# EasyEDA Pro project ProPrj_智能警报器（终版）_2025-03-04_22-10-02_2025-04-22.epro, board 警报发送装置PCB
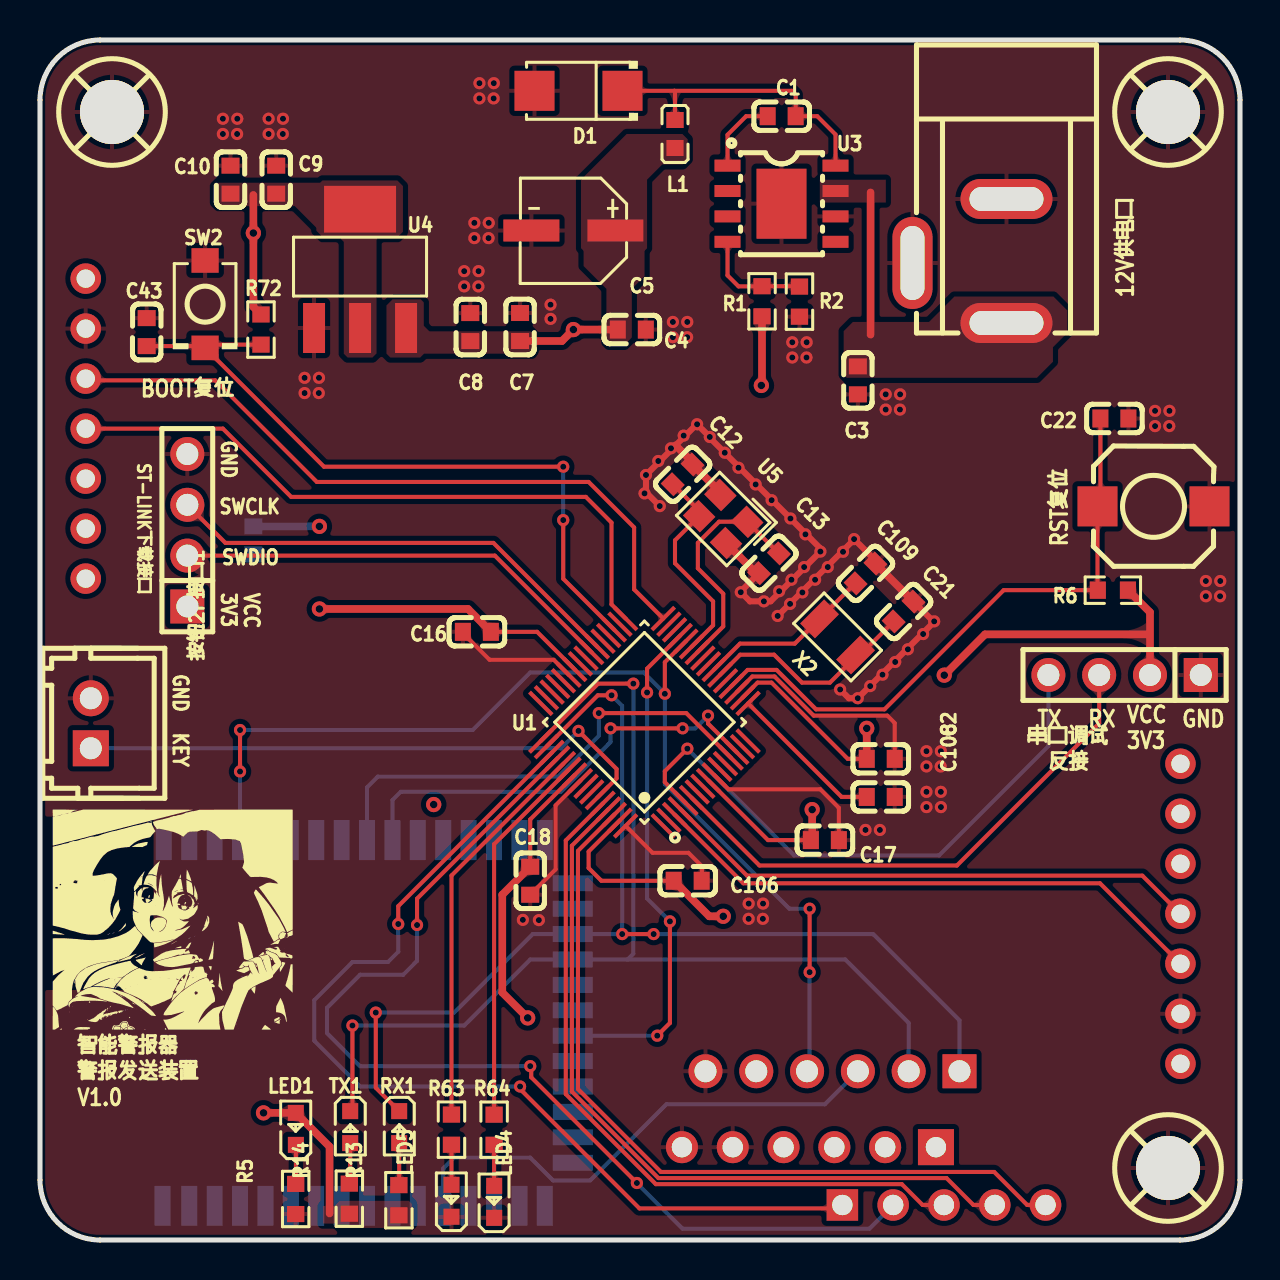
[diagram p18: board, top side]
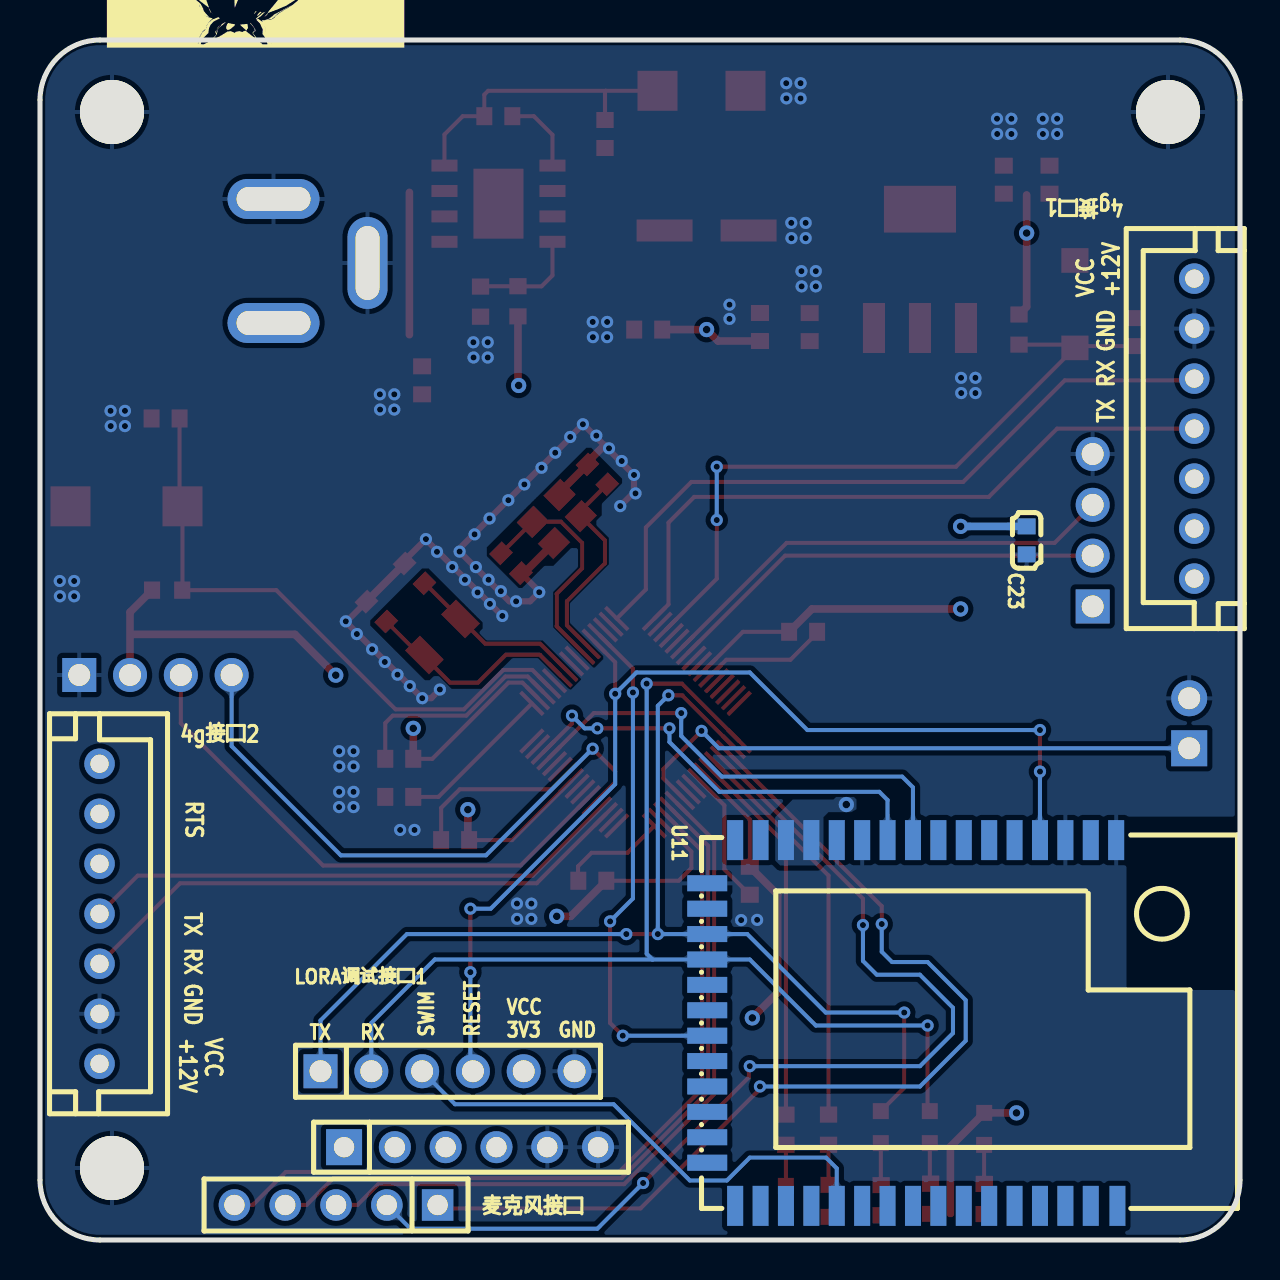
[diagram p19: board, bottom side, seen from below]

Outline 60 x 60 mm; copper layers: Top Layer, 电源层, 接地层, Bottom Layer. Coordinates in mm from the lower left corner of the outline.
Outline path: 0,57 0,3 arc(0.88,0.88) 3,0 57,0 arc(59.12,0.88) 60,3 60,57 arc(59.12,59.12) 57,60 3,60 arc(0.88,59.12) 0,57
Stack: Top Layer 0.035mm 外层铜厚1oz / Dielectric1 0.2104mm 7628 RC49% 8.6mil / 电源层 0.0152mm 内层铜厚 / Dielectric2 1.065mm 1.1mm H/HOZ Copper / 接地层 0.0152mm 内层铜厚 / Dielectric3 0.2104mm 7628 RC49% 8.6mil / Bottom Layer 0.035mm 外层铜厚1oz

## Design rules (mm)
template: 自定义配置
spacing copperThickness1oz (default): track to track 0.102, other pairs 0.152 to 0.3
spacing copperThickness2oz: track to track 0.203, other pairs 0.152 to 0.3
track width copperThickness1oz (default): min 0.203, default 0.203, max 2.54
track width copperThickness2oz: min 0.203, default 0.254, max 2.54
track width GND: min 0.203, default 0.305, max 2.54
track width VCC: min 0.203, default 0.381, max 2.54
differential pair differentialPair (default): width min 0.127, default 0.254, max 2.54; gap min 0.152, default 0.152
via viaSize (default): diameter min 0.5, default 0.61, max 10; hole min 0.3, default 0.305, max 6.299
via VCC: diameter min 0.61, default 0.762, max 10; hole min 0.305, default 0.381, max 6.299
net VCC+3.3V uses VCC
net GND uses GND
net VCC_IN uses VCC
net VCC+5V uses VCC

## Placement (name value [footprint] x y rotation side)
C1  10NF  [C0603]  37.08 56.19 0 top
C2  100nF  [C0603]  42.04 24.06 180 top
C3  10uF  [C0603]  40.89 42.98 90 top
C4  10nF  [C0603]  29.59 45.52 180 top
C5  330uF  [CAP-SMD_BD5.0-L5.3-W5.3-FD]  26.67 50.47 180 top
C7  10uF  [C0603]  24 45.65 270 top
C8  100nF  [C0603]  21.51 45.65 270 top
C9  10uF  [C0603]  11.81 53.02 90 top
C10  100nF  [C0603]  9.53 53.02 90 top
C12  12pF  [C0603]  32.13 38.28 45 top
C13  12pF  [C0603]  36.45 33.84 225 top
C16  100nF  [C0603]  21.84 30.41 0 top
C17  100nF  [C0603]  39.24 20 180 top
C18  100nF  [C0603]  24.51 17.96 90 top
C21  10pF  [C0603]  43.18 31.42 225 top
C22  10nF  [C0603]  53.72 41.08 180 top
C23  100nF  [C0603]  10.67 34.98 90 bottom
C43  100nF  [C0603]  5.33 45.39 270 top
C106  100nF  [C0603]  32.38 17.96 180 top
C108  2.2uF  [C0603]  42.04 22.15 180 top
C109  10pF  [C0603]  41.28 33.33 225 top
D1  B340A  [SMA_L4.3-W2.6-LS5.1-RD]  26.92 57.46 180 top
DC2  -  [DC-005_2.5]  48.01 49.08 90 top
H6  -  [HDR-TH_4P-P2.54-V-M]  7.37 35.49 90 top
H7  -  [HDR-TH_4P-P2.54-V-M]  54.23 28.25 180 top
L1  15uH  [L0603]  31.75 55.3 90 top
LED1  -  [LED_0603]  12.78 5.61 90 top
LED4  KT-0603R  [LED0603-RD]  22.71 1.91 90 top
LED5  KT-0603R  [LED0603-RD]  20.57 1.96 90 top
LORA调试接口1  PZ254-1-06-Z-2.5-G1  [HDR-TH_6P-P2.54-V-M]  39.62 8.44 180 bottom
R1  10KΩ  [R0603]  36.1 46.94 90 top
R2  3.24KΩ  [R0603]  37.97 46.92 270 top
R5  2kΩ  [R0603]  12.78 2.05 270 top
R6  1KΩ  [R0603]  53.64 32.49 0 top
R13  1kΩ  [R0603]  17.94 1.99 270 top
R14  1kΩ  [R0603]  15.47 2.07 270 top
R63  1kΩ  [R0603]  20.57 5.52 90 top
R64  1kΩ  [R0603]  22.7 5.51 90 top
R72  4.7kΩ  [R0603]  11.05 45.52 270 top
RX1  KT-0603R  [LED0603-RD]  17.96 5.64 270 top
SCREW1  -  [M3螺丝]  56.4 56.4 0 top
SCREW2  -  [M3螺丝]  3.6 56.4 0 top
SCREW3  -  [M3螺丝]  56.4 3.6 0 top
SW2  TS-1088-AR02016  [SW-SMD_L3.9-W3.0-P4.45]  8.25 46.79 270 top
TX1  KT-0603R  [LED0603-RD]  15.51 5.64 270 top
U1  HT32F52352  [LQFP-64_L7.0-W7.0-P0.40-LS9.2-BL]  30.22 25.89 45 top
U3  TPS5430DDAR  [ESOP-8_L4.9-W3.9-P1.27-LS6.0-TL-EP]  37.08 51.81 0 top
U4  AMS1117-3.3  [SOT-223-3_L6.5-W3.4-P2.30-LS7.0-BR]  16 48.57 270 top
U5  8MHz  [CRYSTAL-SMD_4P-L2.5-W2.0-BL]  34.16 36.05 135 top
U9  轻触开关/软触开关(无声)/贴片6*6*5  [SW-SMD_L6.0-W5.9-LS6.6]  55.68 36.68 180 top
U11  WH-L101-L-C  [COMM-SMD_WH-L101-L-C]  16.38 10.85 270 bottom
U63  ZX-PM2.54-1-6PY  [HDR-TH_6P-P2.54-V-F]  38.45 4.64 180 bottom
U65  ZX-PM2.54-1-5PY  [HDR-TH_5P-P2.54-V-F-B]  45.2 1.75 0 bottom
U66  ZX-XH2.54-7PZZ  [CONN-TH_7P-P2.50_XH2.54MM-7P]  2.29 40.57 270 bottom
U67  ZX-XH2.54-7PZZ  [CONN-TH_7P-P2.50_XH2.54MM-7P]  57.02 16.31 90 bottom
X2  32.768kHz  [OSC-SMD_L3.2-W1.5]  39.88 30.16 135 top
按钮2P接口1  ZX-XH2.54-2PZZ  [CONN-TH_2P-P2.50_HX25003-2A]  2.54 25.84 90 top

## Footprints (pads in the part's own frame, mm; a bottom-side part is the same pattern mirrored in y, then rotated)
C0603
  rect 0.8x0.9 smd: 1(-0.7,0) 2(0.7,0)
CAP-SMD_BD5.0-L5.3-W5.3-FD
  rect 2.8x1.1 smd: 1(-2.1,0) 2(2.1,0)
COMM-SMD_WH-L101-L-C
  rect 2x0.8 smd: 1(-9.144,10.192) 2(-9.144,8.922) 3(-9.144,7.652) 4(-9.144,6.382) 5(-9.144,5.112) 6(-9.144,3.842) 7(-9.144,2.572) 8(-9.144,1.302) 9(-9.144,0.032) 10(-9.144,-1.238) 11(-9.144,-2.509) 12(-9.144,-3.779) 13(-9.144,-5.048) 14(-9.144,-6.319) 15(-9.144,-7.588) 16(-9.144,-8.858) 29(9.144,-8.858) 30(9.144,-7.588) 31(9.144,-6.319) 32(9.144,-5.048) 33(9.144,-3.779) 34(9.144,-2.509) 35(9.144,-1.238) 36(9.144,0.032) 37(9.144,1.302) 38(9.144,2.572) 39(9.144,3.842) 40(9.144,5.112) 41(9.144,6.382) 42(9.144,7.652) 43(9.144,8.922) 44(9.144,10.255)
  rect 0.8x2 smd: 17(-6.985,-10.255) 18(-5.715,-10.255) 19(-4.445,-10.255) 20(-3.175,-10.255) 21(-1.905,-10.255) 22(-0.635,-10.255) 23(0.635,-10.255) 24(1.905,-10.255) 25(3.175,-10.255) 26(4.445,-10.255) 27(5.715,-10.255) 28(6.985,-10.255)
CONN-TH_2P-P2.50_HX25003-2A
  rect 1.8x1.8 hole 1.1: 1(-1.25,0)
  round 1.8 hole 1.1: 2(1.25,0)
CONN-TH_7P-P2.50_XH2.54MM-7P
  round 1.524 hole 0.914: 1(-7.5,0) 2(-5,0) 3(-2.5,0) 4(0,0) 5(2.5,0) 6(5,0) 7(7.5,0)
CRYSTAL-SMD_4P-L2.5-W2.0-BL
  rect 1.2x1.1 smd: 1(-0.95,-0.75) 2(0.95,-0.75) 3(0.95,0.75) 4(-0.95,0.75)
DC-005_2.5
  oval 2x4.6 hole 1.2x3.7: 1(-3.227,-0.318) 2(2.973,-0.318)
  oval 4.6x2 hole 3.7x1.2: 3(-0.227,4.382)
ESOP-8_L4.9-W3.9-P1.27-LS6.0-TL-EP
  rect 1.3x0.6 smd: 1(-2.7,1.905) 2(-2.7,0.635) 3(-2.7,-0.635) 4(-2.7,-1.905) 5(2.7,-1.905) 6(2.7,-0.635) 7(2.7,0.635) 8(2.7,1.905)
  rect 2.5x3.5 smd: 9(0,0)
HDR-TH_4P-P2.54-V-M
  rect 1.7x1.7 hole 1.1: 1(-3.81,0)
  round 1.7 hole 1.1: 2(-1.27,0) 3(1.27,0) 4(3.81,0)
HDR-TH_5P-P2.54-V-F-B
  rect 1.575x1.575 hole 1.02: 1(-5.08,0)
  round 1.575 hole 1.02: 2(-2.54,0) 3(0,0) 4(2.54,0) 5(5.08,0)
HDR-TH_6P-P2.54-V-F
  rect 1.8x1.8 hole 1.02: 1(-6.35,0)
  round 1.6 hole 1.02: 2(-3.81,0) 3(-1.27,0) 4(1.27,0) 5(3.81,0) 6(6.35,0)
HDR-TH_6P-P2.54-V-M
  rect 1.7x1.7 hole 1.1: 1(-6.35,0)
  round 1.7 hole 1.1: 2(-3.81,0) 3(-1.27,0) 4(1.27,0) 5(3.81,0) 6(6.35,0)
L0603
  rect 0.8x0.864 smd: 1(-0.7,0) 2(0.7,0)
LED0603-RD
  rect 0.8x0.8 smd: 1(-0.799,0) 2(0.799,0)
LED_0603
  rect 0.8x0.8 smd: 1(-0.851,-0.01) 2(0.75,-0.005)
LQFP-64_L7.0-W7.0-P0.40-LS9.2-BL
  rect 0.2x1.6 smd: 1(-3,-4.33) 2(-2.6,-4.33) 3(-2.2,-4.33) 4(-1.8,-4.33) 5(-1.4,-4.33) 6(-1,-4.33) 7(-0.6,-4.33) 8(-0.2,-4.33) 9(0.2,-4.33) 10(0.6,-4.33) 11(1,-4.33) 12(1.4,-4.33) 13(1.8,-4.33) 14(2.2,-4.33) 15(2.6,-4.33) 16(3,-4.33) 33(3,4.33) 34(2.6,4.33) 35(2.2,4.33) 36(1.8,4.33) 37(1.4,4.33) 38(1,4.33) 39(0.6,4.33) 40(0.2,4.33) 41(-0.2,4.33) 42(-0.6,4.33) 43(-1,4.33) 44(-1.4,4.33) 45(-1.8,4.33) 46(-2.2,4.33) 47(-2.6,4.33) 48(-3,4.33)
  rect 1.6x0.2 smd: 17(4.33,-3) 18(4.33,-2.6) 19(4.33,-2.2) 20(4.33,-1.8) 21(4.33,-1.4) 22(4.33,-1) 23(4.33,-0.6) 24(4.33,-0.2) 25(4.33,0.2) 26(4.33,0.6) 27(4.33,1) 28(4.33,1.4) 29(4.33,1.8) 30(4.33,2.2) 31(4.33,2.6) 32(4.33,3) 49(-4.33,3) 50(-4.33,2.6) 51(-4.33,2.2) 52(-4.33,1.8) 53(-4.33,1.4) 54(-4.33,1) 55(-4.33,0.6) 56(-4.33,0.2) 57(-4.33,-0.2) 58(-4.33,-0.6) 59(-4.33,-1) 60(-4.33,-1.4) 61(-4.33,-1.8) 62(-4.33,-2.2) 63(-4.33,-2.6) 64(-4.33,-3)
M3螺丝
  round 3.2 hole 3.2: 1(0,0)
OSC-SMD_L3.2-W1.5
  rect 1.05x1.7 smd: 1(-1.275,0) 2(1.275,0)
R0603
  rect 0.806x0.864 smd: 1(-0.753,0) 2(0.753,0)
SMA_L4.3-W2.6-LS5.1-RD
  rect 2x2 smd: 1(-2.2,0) 2(2.2,0)
SOT-223-3_L6.5-W3.4-P2.30-LS7.0-BR
  rect 2.5x1.1 smd: 1(2.97,-2.3) 2(2.97,0) 3(2.97,2.3)
  rect 2.34x3.6 smd: 4(-2.97,0)
SW-SMD_L3.9-W3.0-P4.45
  rect 1.23x1.36 smd: 1(-2.185,0) 2(2.185,0)
SW-SMD_L6.0-W5.9-LS6.6
  rect 2x2 smd: 1(-2.8,0) 2(2.8,0)

## Nets
As in the schematic.

Pads without a net: U1 1 2 7 8 11 12 15 16 21 24 25 30 31 36 40 41 44 45 46 47 48 57 58; U3 2 3 5; U11 2 5 6 7 8 15 16 18 21 22 24 25 26 27 28 29 30 31 32 34 35 36 37 38 39 40 41 42 43 44; U63 1 3 4; U66 5 7; U67 5 7

## Via types
v1: diameter 0.762, hole 0.381, Top Layer to Bottom Layer, 12 vias
v2: diameter 0.61, hole 0.305, Top Layer to Bottom Layer, 124 vias

## Routing (per net, layer and track width the routed paths; a pad name or vN(x,y) marks a point on that pad's centre or on a via; arc(x,y) is an arc through that point)
GND: length 82.3
  Top Layer w0.203: U1.10 34.43,22.53 39.01,22.53 39.94,21.61 C17.1 ; 26.45,28.24 25.69,29.01 22.48,29.01 21.14,30.35 C16.1 ; C2.1 42.74,25.85 42.37,26.22 38.69,26.22 36.73,28.17 35.62,28.17 U1.19 ; 27.02,22.97 25.78,21.73 25.78,18.53 24.51,17.26 ; 29.28,20.71 30.63,19.36 32.42,19.36 33.1,18.69 33.1,17.97 C106.1
  Top Layer w0.305: 43.68,31.92 44.66,30.93 v2(44.71,30.93) 44.71,30.91 v2(40.89,27.09) 40.44,27.09 v2(40.01,27.52) ; C109.1 41.77,33.98 v2(40.7,35.04) 40.7,35.02 v2(36.88,31.2) ; v2(30.99,36.7) 30.35,37.33 v2(30.23,37.33) 30.3,37.4 v2(30.3,38.25) 31.78,39.73 32.83,40.79 v2(32.85,40.79) v2(33.49,40.15) 33.49,40.11 v2(34.24,39.36) 34.24,39.36 v2(37.52,36.08) 39.02,34.58 v2(39.02,34.42) 36.53,31.93 v2(36.19,31.93) 35.5,31.93 v2(35.04,32.39) 35.04,32.43 C13.2
  Top Layer w0.381: C109.1 43.68,31.92 ; 31.78,39.73 32.63,38.89 C12.2 34.02,37.39 U5.2 ; C13.2 35.81,33.34 U5.4
  vias: v2(9.14,56.06) v2(9.14,55.3) v2(9.86,56.06) v2(9.85,55.3) v2(11.43,56.06) v2(11.43,55.3) v2(12.15,56.06) v2(12.14,55.3) v2(13.23,43.11) v2(13.23,42.35) v2(13.95,43.11) v2(13.94,42.35) v2(21.21,48.44) v2(21.21,47.68) v2(21.72,50.86) v2(21.72,50.09) v2(21.93,48.44) v2(21.92,47.68) v2(21.97,57.84) v2(21.97,57.08) v2(22.44,50.86) v2(22.43,50.09) v2(22.69,57.84) v2(22.68,57.08) v2(24.14,16.01) v2(24.94,15.99) v2(25.53,46.77) v2(25.53,46.06) v2(30.91,38.95) v2(31.55,39.58) v2(31.64,45.9) v2(31.64,45.14) v2(32.18,40.22) v2(32.36,45.9) v2(32.36,45.14) v2(34.93,38.61) v2(35.43,16.82) v2(35.43,16.06) v2(35.78,37.78) v2(36.14,16.06) v2(36.15,16.82) v2(36.58,36.99) v2(36.96,32.44) v2(37.5,31.81) v2(37.61,44.89) v2(37.61,44.12) v2(37.57,33.01) v2(38.12,32.38) v2(38.21,33.65) v2(38.33,44.89) v2(38.32,44.12) v2(38.27,35.28) v2(38.75,33.01) v2(39.39,33.65) v2(40.15,34.41) v2(41.28,20.5) v2(41.51,27.69) v2(41.99,20.5) v2(42.12,28.27) v2(42.29,42.28) v2(42.29,41.52) v2(42.76,28.9) v2(43.01,42.28) v2(43,41.52) v2(43.4,29.54) v2(44.16,30.3) v2(44.32,24.44) v2(44.32,23.68) v2(44.32,22.41) v2(44.32,21.65) v2(45.04,24.44) v2(45.03,23.68) v2(45.04,22.41) v2(45.05,21.65) v2(55.75,41.46) v2(55.75,40.7) v2(56.47,41.46) v2(56.46,40.7) v2(58.29,32.95) v2(58.29,32.19) v2(59.01,32.95) v2(59,32.19)
VCC+3.3V: length 202.6
  Top Layer w0.203: C106.2 28.07,17.96 27.43,18.6 27.43,19.42 U1.63 ; C17.2 36.4,20 33.43,22.97 ; C16.2 24.85,30.41 U1.42 ; 41.34,24.06 40.39,24.06 36.58,27.87 35.88,27.87 U1.18 ; U1.55 24.51,21.03 C18.2
  Top Layer w0.381: C18.2 23.11,17.27 23.11,12.38 v1(24.38,11.1) ; v1(45.21,28.24) 47.25,30.28 55.37,30.28 ; C16.2 21.4,31.55 v1(13.97,31.55) ; R72.1 10.67,46.66 v1(10.67,50.35) 10.67,52.25 ; v1(11.18,6.36) LED1.2 14.48,4.67 14.48,1.33 ; v1(34.16,16.19) 33.46,16.19 C106.2 ; v1(38.61,21.52) 38.61,20.06 C17.2 ; R6.2 55.5,31.39 H7.2 ; 41.34,24.06 v1(41.34,25.58)
  电源层 w0.381: v1(34.16,16.19) 34.16,21.48 ; v1(34.16,16.19) 32,18.34 23.11,18.34 v1(19.69,21.77) 13.97,27.49 v1(13.97,31.55) ; v1(34.16,16.19) 34.16,11.07 ; 34.16,21.48 34.16,22.92 36.83,25.58 v1(41.34,25.58) 42.55,25.58 v1(45.21,28.24) ; 34.16,21.48 34.2,21.52 v1(38.61,21.52) ; H6.1 7.49,31.55 v1(13.97,31.55) ; 34.16,11.07 34.16,10.09 LORA调试接口1.5 ; 34.16,11.07 34.13,11.1 v1(24.38,11.1) 19.63,6.36 v1(11.18,6.36) ; v1(13.97,31.55) v1(13.97,35.68) 13.97,39.3 10.67,42.6 v1(10.67,50.35)
  Bottom Layer w0.381: C23.2 v1(13.97,35.68)
VCC+5V: length 69.5
  Top Layer w0.381: v1(36.07,42.73) 36.1,42.76 36.1,46.18 ; C7.2 26.1,44.95 v1(26.67,45.52) C4.2
  电源层 w0.381: U63.2 42.26,6.25 42.54,6.53 47.62,6.53 49.15,8.06 49.15,15.17 46.1,18.22 46.1,32.69 v1(36.07,42.73) 27.81,42.73 26.67,43.87 v1(26.67,45.52)
VCC_IN: length 105.8
  Top Layer w0.381: 41.53,52.38 41.53,45.27
  电源层 w0.762: U66.1 7.11,52.89 7.11,55.94 9.14,57.97 18.29,57.97 24,52.25 28.45,52.25 34.85,45.85 DC2.1 48.32,23.36 51.94,19.74 51.94,11.99 55.12,8.81 U67.1
4G_RX1: length 35.7
  Top Layer w0.203: 31.16,31.07 29.71,32.53 29.71,35.63 27.43,37.9 13.84,37.9 8.76,42.98 2.37,42.98 U66.3
4G_RX2: length 28.4
  Top Layer w0.203: U67.3 53,17.84 35.16,17.84 U1.3
4G_TX1: length 33.3
  Top Layer w0.203: 29.28,31.07 28.57,31.78 28.57,35.87 27.29,37.16 12.56,37.16 9.14,40.57 U66.4
4G_TX2: length 27.2
  Top Layer w0.203: 32.01,21.56 35.35,18.22 55.12,18.22 U67.4
BEEP_PA25: length 50.4
  Top Layer w0.203: U65.1 39.95,1.58 29.97,1.58 24,7.55 v2(24,7.68) ; v2(17.91,15.8) 17.91,16.69 U1.51
  Bottom Layer w0.203: v2(24,7.68) 16,7.68 13.72,9.96 13.72,11.99 15.62,13.9 17.4,13.9 17.91,14.41 v2(17.91,15.8)
BEEP_PA26: length 53.2
  Top Layer w0.203: v2(18.85,15.75) 18.85,17.07 25.89,24.1 ; v2(24.51,8.69) 24.51,8.75 24.56,8.8 24.56,8.13 v2(29.84,2.85)
  Bottom Layer w0.203: U65.2 41.47,0.56 32.13,0.56 v2(29.84,2.85) ; v2(24.51,8.69) 16,8.69 14.35,10.34 14.35,11.61 16,13.26 18.16,13.26 18.85,13.95 v2(18.85,15.75)
BEEP_PA27: length 36.5
  Top Layer w0.203: U65.3 44.13,1.75 43.09,2.79 30.79,2.79 26.29,7.29 26.29,19.98 U1.60
BEEP_PB2: length 38.4
  Top Layer w0.203: U65.4 46.67,1.75 45.32,3.1 30.92,3.1 26.59,7.42 26.59,19.72 28.43,21.56
BEEP_PB3: length 40.3
  Top Layer w0.203: U65.5 49.36,1.75 47.71,3.4 31.04,3.4 26.9,7.55 26.9,19.46 U1.62
BOOT: length 35.4
  Top Layer w0.203: SW2.2 8.17,44.69 C43.2 ; SW2.2 8.42,44.77 R72.2 ; SW2.2 14.2,38.66 v2(26.16,38.66) ; v2(26.16,36) 26.16,33.06 U1.35
  Bottom Layer w0.203: v2(26.16,36) v2(26.16,38.66)
LORA_IO1: length 24
  Top Layer w0.203: v2(27.94,26.34) 32.31,26.34 34.56,24.1
  Bottom Layer w0.203: U11.9 16.35,22.63 16.89,23.17 25.91,23.17 27.94,25.2 v2(27.94,26.34)
LORA_IO2: length 22.4
  Top Layer w0.203: U1.14 33.4,25.82 v2(33.4,26.22) ; v2(28.53,25.58) v2(32.13,25.58)
  Bottom Layer w0.203: v2(28.53,25.58) 28.53,24.9 26.03,22.41 18.03,22.41 17.62,22 U11.10 ; v2(32.13,25.58) 32.77,25.58 v2(33.4,26.22)
LORA_RESET: length 54
  Top Layer w0.203: U1.28 31.24,28.89 v2(31.24,27.31) ; v2(10,23.42) v2(10,25.5) ; v2(38.48,16.57) v2(38.48,13.39)
  Bottom Layer w0.203: LORA调试接口1.4 38.48,8.56 v2(38.48,13.39) ; v2(38.48,16.57) 37.47,16.57 31.24,22.79 v2(31.24,27.31) 30.18,28.38 24.51,28.38 21.63,25.5 v2(10,25.5) ; 10,20 v2(10,23.42)
LORA_RX: length 57
  Top Layer w0.203: 25.04,24.95 27.91,27.82 v2(29.67,27.82) ; v2(15.62,10.72) 15.62,6.55 15.51,6.44
  Bottom Layer w0.203: 29.38,14.03 U11.20 24.51,14.03 21.21,10.72 v2(15.62,10.72) ; 29.38,14.03 29.67,14.31 v2(29.67,27.82) ; 29.38,14.03 40.26,14.03 43.43,10.85 LORA调试接口1.2
LORA_SWIM: length 25.6
  Bottom Layer w0.203: U11.33 20.16,3.58 20.7,4.12 24.51,4.12 25.65,2.98 27.51,2.98 31.32,6.79 39.24,6.79 LORA调试接口1.3
LORA_TX: length 57
  Top Layer w0.203: U1.50 27.89,27.24 v2(28.58,27.24) ; v2(16.79,11.37) 16.79,7.61 17.96,6.44 ; v2(29.11,15.3) v2(30.68,15.3)
  Bottom Layer w0.203: v2(28.58,27.24) 29.11,26.71 v2(29.11,15.3) U11.19 24.64,15.3 20.71,11.37 v2(16.79,11.37) ; v2(30.68,15.3) 41.66,15.3 45.97,10.98 LORA调试接口1.1
LORA_WAKE: length 25.7
  Top Layer w0.203: v2(31.5,15.93) 31.5,10.85 v2(30.86,10.22) ; v2(30.35,27.38) 30.35,28.57 32.01,30.22
  Bottom Layer w0.203: v2(31.5,15.93) 30.35,17.07 v2(30.35,27.38) ; U11.23 v2(30.86,10.22)
NRST: length 30.6
  Top Layer w0.203: 34.56,27.68 35.38,28.5 36.83,28.5 38.8,26.53 42.22,26.53 48.18,32.49 52.89,32.49 52.88,32.51 U9.2 53.02,36.83 53.02,41.08
PA4: length 29.7
  Top Layer w0.203: v2(32.37,24.57) 31.24,23.44 31.24,22.89 U1.5
  Bottom Layer w0.203: v2(32.37,24.57) 37.7,19.23 44.96,19.23 50.42,24.69 H7.4
PA5: length 27.1
  Top Layer w0.203: 32.58,22.12 35.97,18.72 45.85,18.72 52.96,25.84 H7.3
PA12: length 23.4
  Top Layer w0.203: 27.87,29.66 22.67,34.85 9.27,34.85 H6.3
PA13: length 22.2
  Top Layer w0.203: H6.2 22.74,34.22 U1.39
PC3: length 29.3
  Top Layer w0.203: 27.87,22.12 28.83,23.08 28.83,23.55 v2(26.92,25.46)
  Bottom Layer w0.203: 按钮2P接口1.1 26.06,24.59 v2(26.92,25.46)
PC14: length 19.9
  Top Layer w0.203: R63.2 20.57,18.22 U1.53
PC15: length 18.8
  Top Layer w0.203: R64.2 22.7,19.79 26.45,23.54
X32KIN: length 11
  Top Layer w0.203: 33.99,28.24 35.01,29.27 36.7,29.27 38.1,27.87 39.5,27.87 40.78,29.15 X2.1 41.01,29.25 42.69,30.93
X32KOUT: length 8.9
  Top Layer w0.203: U1.23 35,29.82 37.74,29.82 X2.2 40.75,32.83 C109.2
XATLOUT: length 10.4
  Top Layer w0.203: C12.1 32.96,36.47 U5.3 31.75,34.98 31.75,33.84 33.66,31.93 33.66,30.74 32.58,29.66
XTALIN: length 11.7
  Top Layer w0.203: U1.26 34.16,30.68 34.16,32.31 32.89,33.58 32.89,34.85 33.95,35.92 35.35,35.92 36.94,34.33 C13.1
$2N8921: length 7.9
  Top Layer w0.203: 41.34,22.15 40.08,22.15 35.41,26.83
$2N22907: length 2.1
  Top Layer w0.203: R64.1 22.7,2.71 LED4.2
$2N22912: length 2
  Top Layer w0.203: R63.1 LED5.2
$3N414: length 15.2
  Top Layer w0.203: 31.72,57.46 37.59,57.46 37.78,57.27 C1.2 38.86,56.19 39.78,55.28 U3.8 ; 31.72,57.46 31.75,57.43 L1.2 ; 31.72,57.46 D1.1
$3N415: length 3.9
  Top Layer w0.203: C1.1 35.31,56.19 34.38,55.26 U3.1
$3N416: length 5.5
  Top Layer w0.203: R2.1 37.96,47.69 R1.2 36.09,47.68 34.93,47.68 34.38,48.23 U3.4
$3N4500: length 2
  Top Layer w0.203: R5.1 12.79,2.81 LED1.1
$4N844: length 2.1
  Top Layer w0.203: RX1.2 17.96,2.76 R13.1
$4N845: length 2
  Top Layer w0.203: TX1.2 15.51,2.86 R14.1

## Copper pours and planes (outline as drawn; the poured copper is in the pictures)
GND on Top Layer: -1.02,60.89 61.21,60.89 61.21,-0.58 -1.02,-0.58
GND on Bottom Layer: -1.02,60.89 61.21,60.89 61.21,-0.58 -1.02,-0.58
GND on 接地层: -1.02,60.89 61.21,60.89 61.21,-0.58 -1.02,-0.58
VCC+3.3V on Top Layer: 8.75,52.86 18.03,52.86 18.03,50.22 8.75,50.22
VCC+3.3V on Top Layer: 13.82,52.98 18.15,52.98 18.15,44.12 13.82,44.12
VCC+3.3V on Top Layer: 14.14,1.96 18.6,1.96 18.6,0.6 14.14,0.6
VCC+3.3V on Bottom Layer: 19.18,22.15 23.24,22.15 23.24,18.72 19.18,18.72
VCC+5V on Top Layer: 27.05,55.3 32.38,55.3 32.38,49.33 27.05,49.33
VCC+5V on Top Layer: 17.32,47.03 24.68,47.03 24.68,44.12 17.32,44.12
VCC+5V on Top Layer: 27.18,51.24 30.23,51.24 30.23,44.76 27.18,44.76
VCC_IN on Top Layer: 38.99,53.02 42.29,53.02 42.29,51.87 38.99,51.87
VCC_IN on Top Layer: 40.18,47.17 51.36,47.17 51.36,43.11 40.18,43.11

Small or netless copper shapes (teardrops, artwork), in the pictures only: 179 on Top Layer, 48 on Bottom Layer, 26 on 电源层

## Text on the board
Bottom Silkscreen Layer: GND | RESET | SWIM | VCC / 3V3 | RX | TX | RTS | VCC / +12V | 麦克风接口 | 4g接口1 | 4g接口2
Top Silkscreen Layer: SWCLK | SWDIO | GND | KEY | VCC / 3V3 | TX | RX | ST-LINK下载接口 | RST复位 | 智能警报器 / 警报发送装置 / V1.0 | BOOT复位 | 12V供电口 | 串口调试 / 反接
